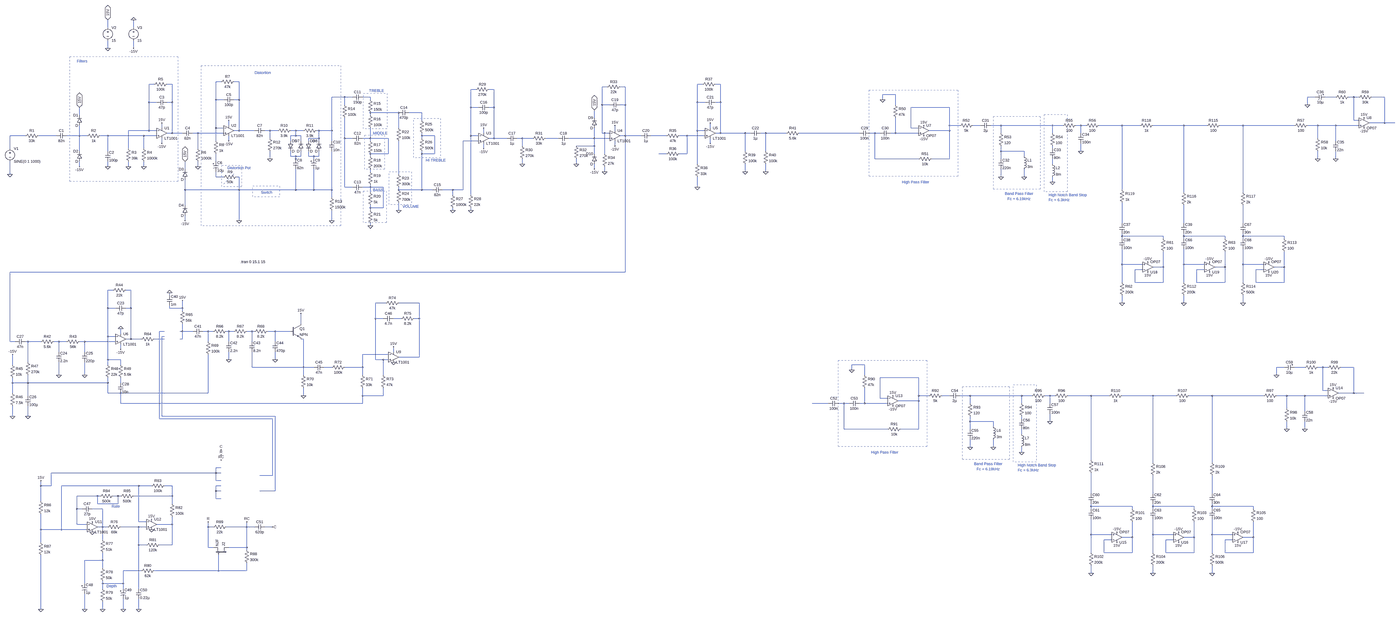
[diagram p0: schematic JC77.asc, whole sheet]
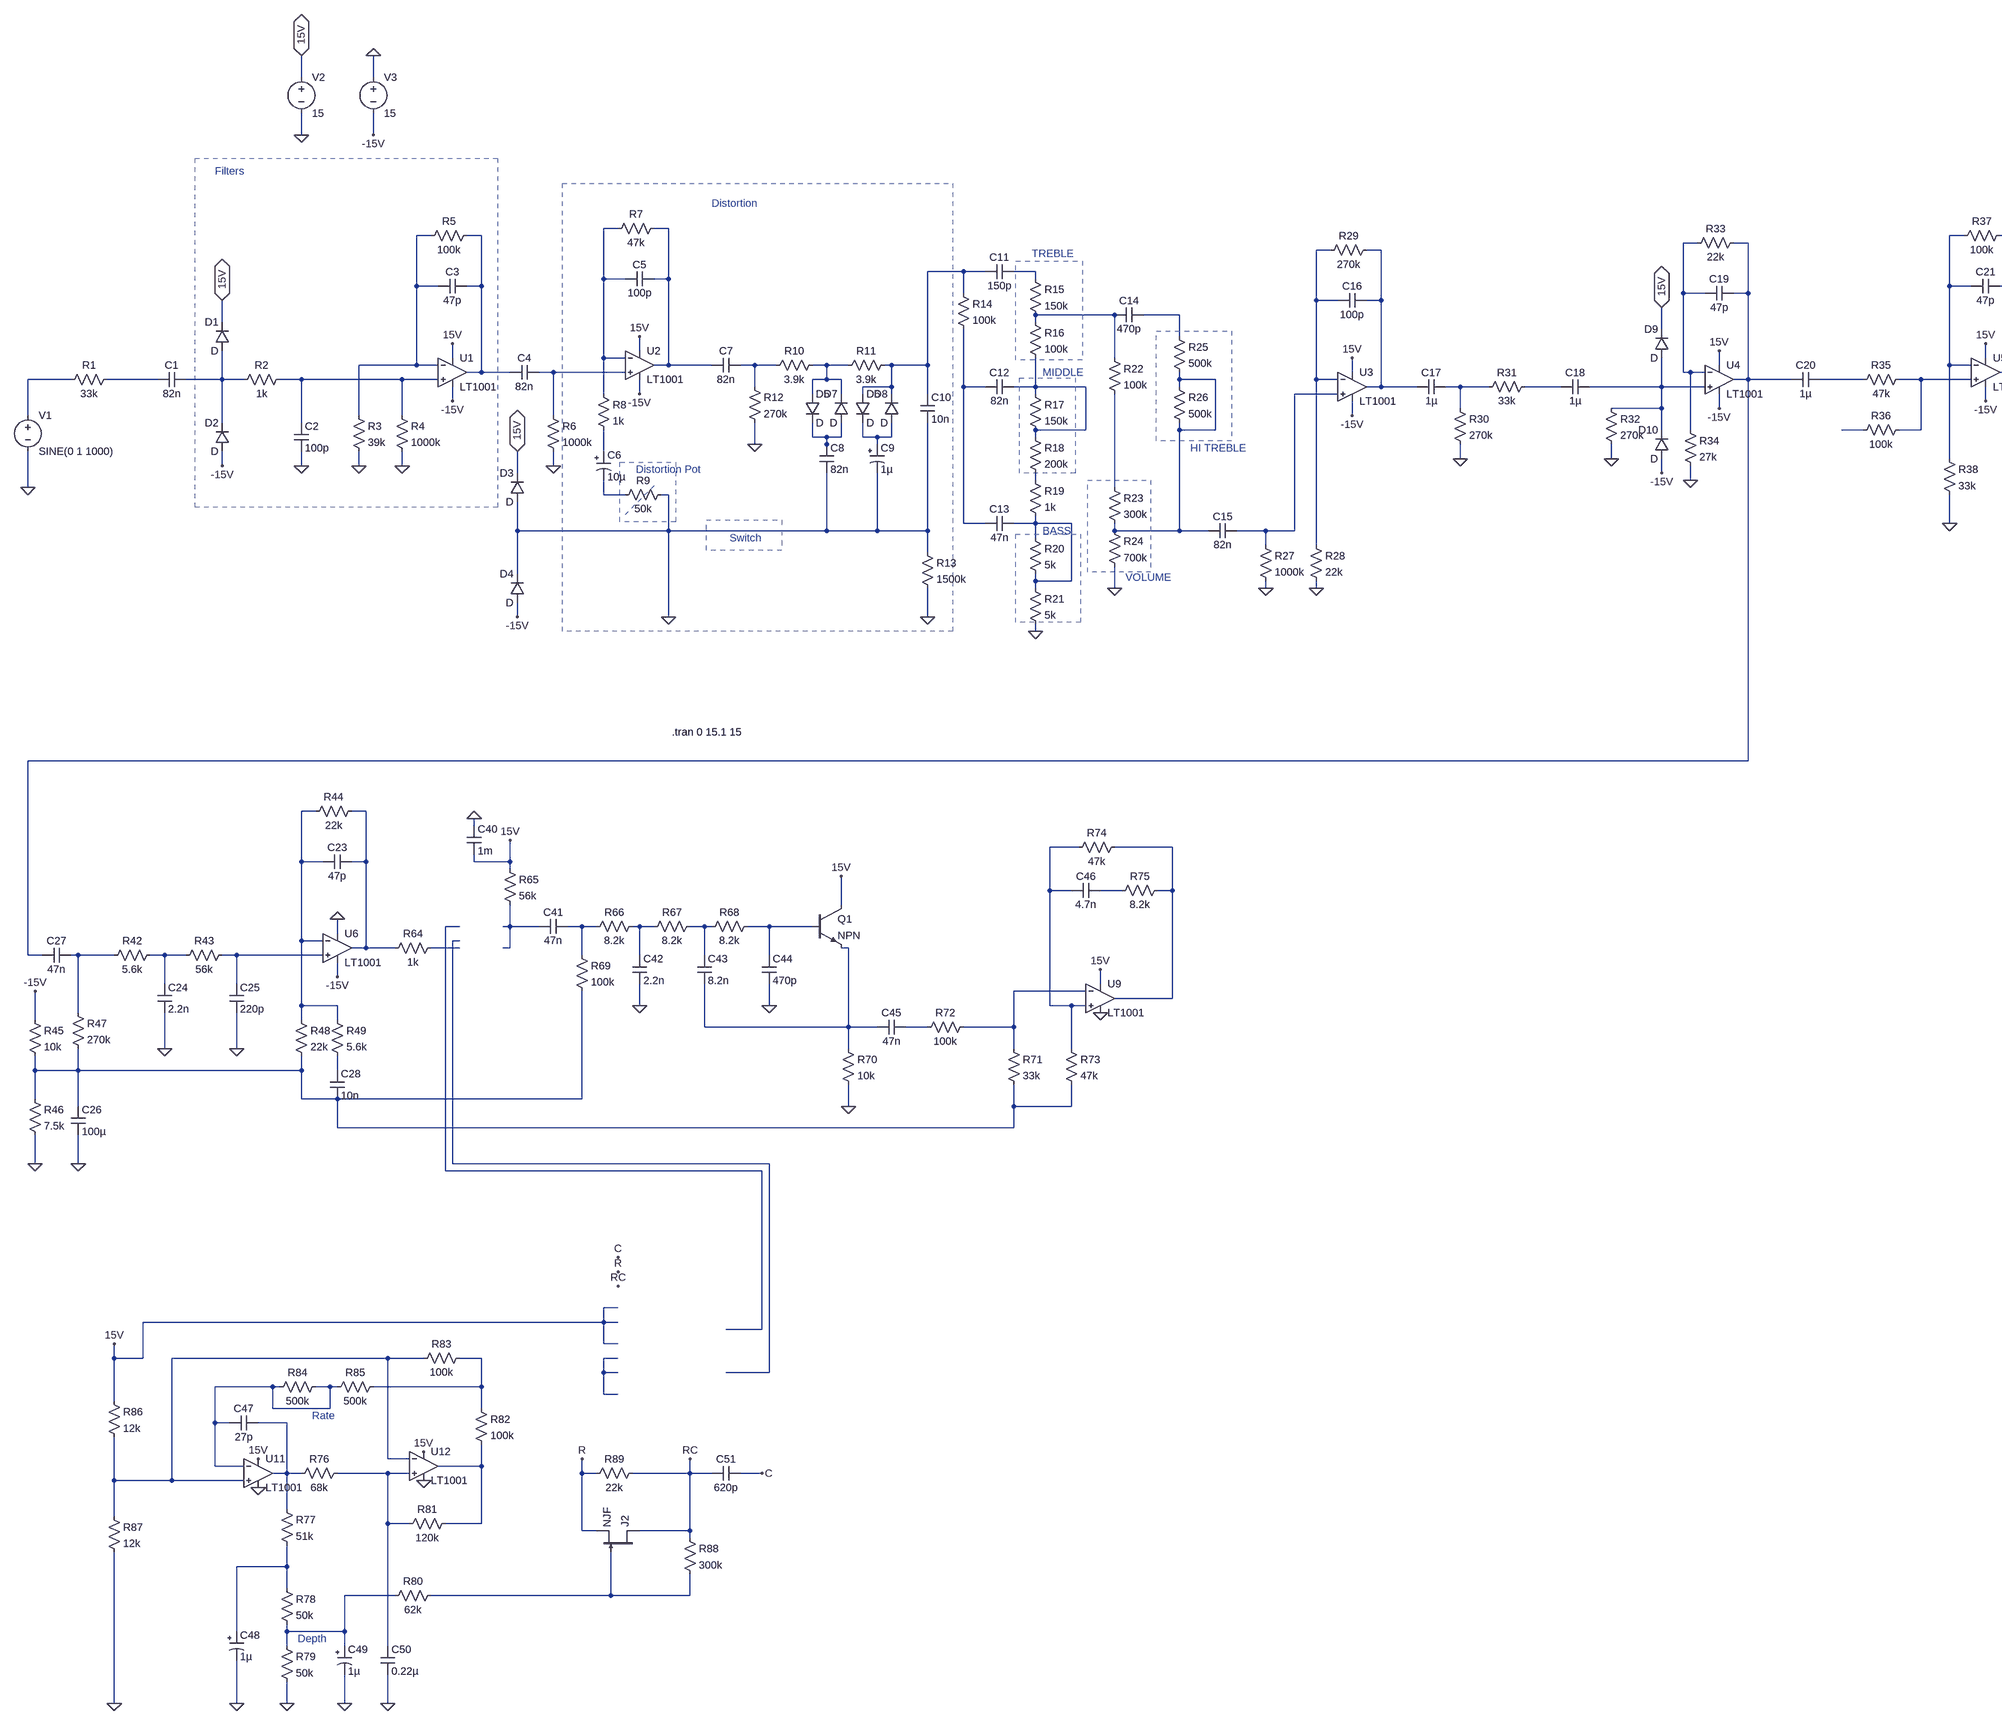
[diagram p1: schematic JC77.asc, part, row 1 of 1, column 1 of 2]
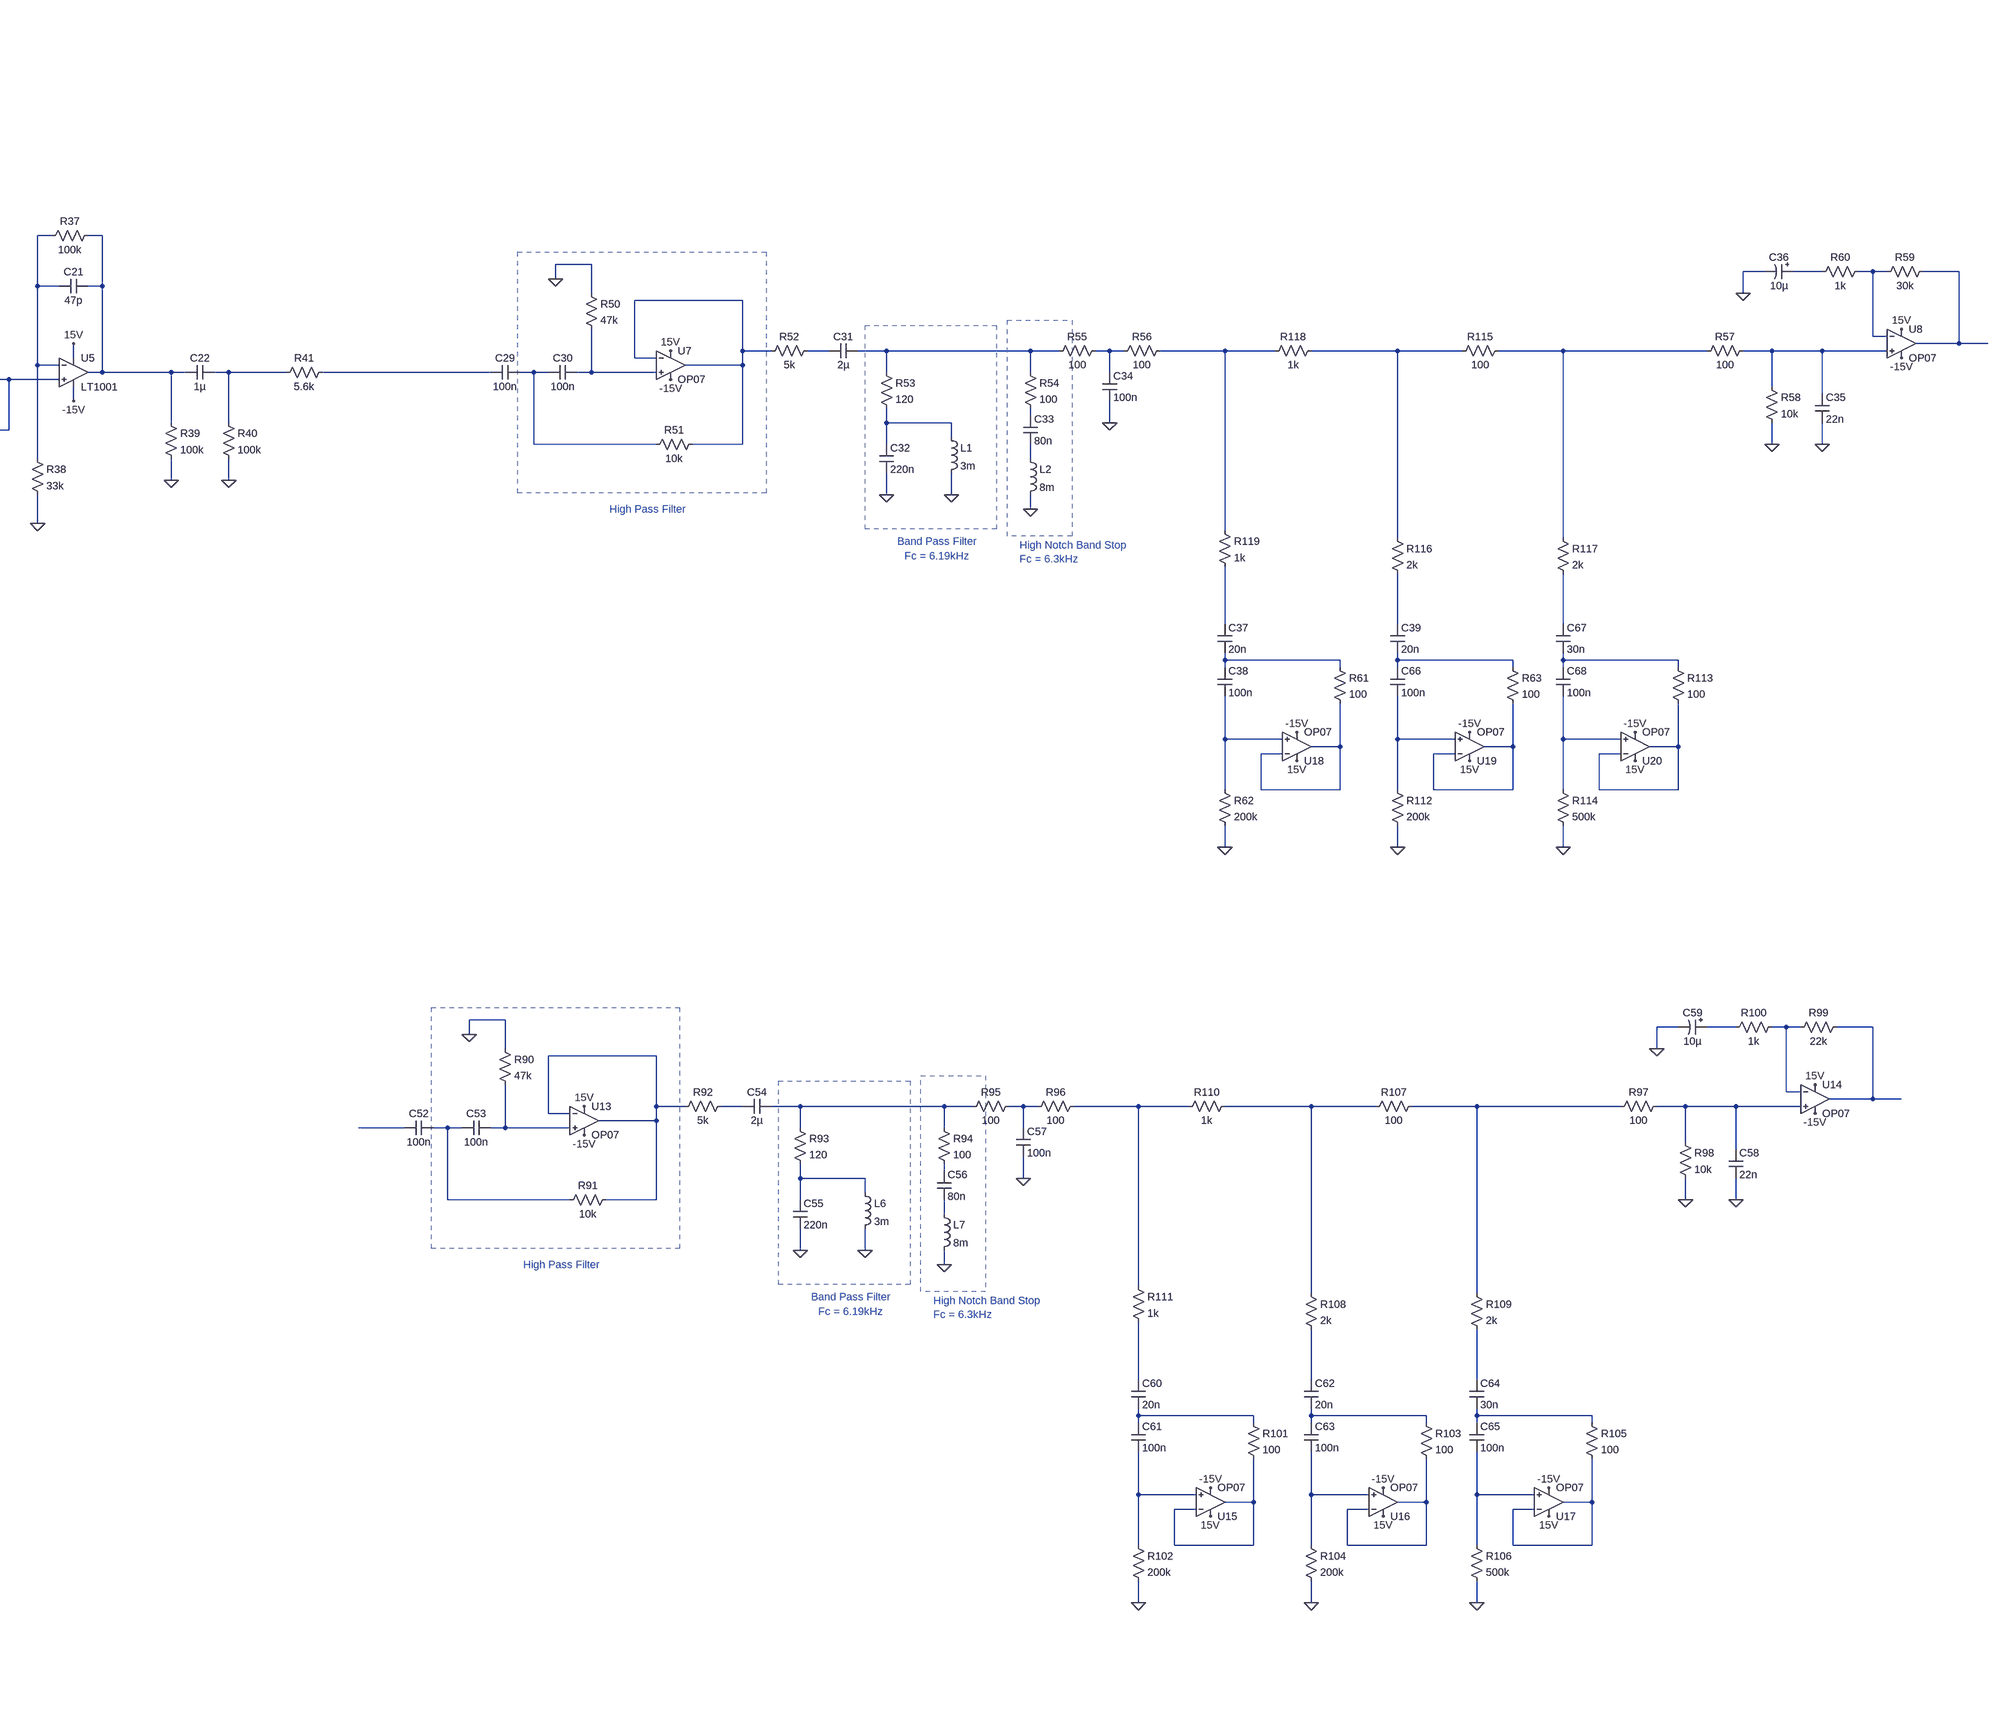
[diagram p2: schematic JC77.asc, part, row 1 of 1, column 2 of 2]
JC77.asc, the LTspice schematic file:
Version 4
SHEET 1 8596 3152
WIRE 496 -480 496 -528
WIRE 656 -480 656 -528
WIRE 496 -352 496 -400
WIRE 656 -352 656 -400
WIRE 1200 -144 1168 -144
WIRE 1312 -144 1280 -144
WIRE 784 -128 752 -128
WIRE 896 -128 864 -128
WIRE 4192 -128 4160 -128
WIRE 4304 -128 4272 -128
WIRE 3600 -112 3568 -112
WIRE 3712 -112 3680 -112
WIRE 2784 -96 2752 -96
WIRE 2896 -96 2864 -96
WIRE 5488 -64 5408 -64
WIRE 1968 -48 1888 -48
WIRE 2016 -48 1968 -48
WIRE 2128 -48 2080 -48
WIRE 8096 -48 8048 -48
WIRE 8224 -48 8160 -48
WIRE 8336 -48 8304 -48
WIRE 8368 -48 8336 -48
WIRE 8528 -48 8448 -48
WIRE 1168 -32 1168 -144
WIRE 1216 -32 1168 -32
WIRE 1312 -32 1312 -144
WIRE 1312 -32 1280 -32
WIRE 2128 -32 2128 -48
WIRE 5408 -32 5408 -64
WIRE 752 -16 752 -128
WIRE 800 -16 752 -16
WIRE 896 -16 896 -128
WIRE 896 -16 864 -16
WIRE 4160 -16 4160 -128
WIRE 4208 -16 4160 -16
WIRE 4304 -16 4304 -128
WIRE 4304 -16 4272 -16
WIRE 1968 0 1968 -48
WIRE 3568 0 3568 -112
WIRE 3616 0 3568 0
WIRE 3712 0 3712 -112
WIRE 3712 0 3680 0
WIRE 5488 0 5488 -64
WIRE 8048 0 8048 -48
WIRE 2752 16 2752 -96
WIRE 2800 16 2752 16
WIRE 2896 16 2896 -96
WIRE 2896 16 2864 16
WIRE 5824 16 5584 16
WIRE 2304 48 2128 48
WIRE 2448 48 2368 48
WIRE 320 64 320 16
WIRE 2128 64 2128 48
WIRE 3520 80 3520 32
WIRE 2448 96 2448 48
WIRE 8336 96 8336 -48
WIRE 8368 96 8336 96
WIRE 8528 112 8528 -48
WIRE 8528 112 8432 112
WIRE 8592 112 8528 112
WIRE 1248 128 1248 96
WIRE 5824 128 5824 16
WIRE 5888 128 5824 128
WIRE 6016 128 5968 128
WIRE 6144 128 6080 128
WIRE 6464 128 6144 128
WIRE 6528 128 6464 128
WIRE 6640 128 6608 128
WIRE 6672 128 6640 128
WIRE 6896 128 6752 128
WIRE 7008 128 6896 128
WIRE 7280 128 7088 128
WIRE 7424 128 7280 128
WIRE 7648 128 7504 128
WIRE 7968 128 7648 128
WIRE 8112 128 8048 128
WIRE 8224 128 8112 128
WIRE 8368 128 8224 128
WIRE 832 144 832 112
WIRE 1168 144 1168 -32
WIRE 1216 144 1168 144
WIRE 2304 144 2304 48
WIRE 4240 144 4240 112
WIRE 5584 144 5584 16
WIRE 5632 144 5584 144
WIRE 752 160 752 -16
WIRE 752 160 624 160
WIRE 800 160 752 160
WIRE 1312 160 1312 -32
WIRE 1312 160 1280 160
WIRE 1408 160 1312 160
WIRE 1504 160 1472 160
WIRE 1552 160 1504 160
WIRE 1664 160 1632 160
WIRE 1712 160 1664 160
WIRE 1808 160 1792 160
WIRE 1888 160 1888 -48
WIRE 1888 160 1808 160
WIRE 3648 160 3648 128
WIRE 4160 160 4160 -16
WIRE 4208 160 4160 160
WIRE 5824 160 5824 128
WIRE 5824 160 5696 160
WIRE 896 176 896 -16
WIRE 896 176 864 176
WIRE 960 176 896 176
WIRE 1056 176 1024 176
WIRE 1216 176 1056 176
WIRE 2832 176 2832 144
WIRE 3568 176 3568 0
WIRE 3584 176 3568 176
WIRE 3616 176 3584 176
WIRE 4304 176 4304 -16
WIRE 4304 176 4272 176
WIRE 4512 176 4304 176
WIRE 4544 176 4512 176
WIRE 4640 176 4608 176
WIRE 4768 176 4640 176
WIRE 5264 176 4848 176
WIRE 5360 176 5328 176
WIRE 5392 176 5360 176
WIRE 5488 176 5488 80
WIRE 5488 176 5456 176
WIRE 5632 176 5488 176
WIRE 6144 176 6144 128
WIRE 6464 176 6464 128
WIRE 6640 176 6640 128
WIRE -16 192 -112 192
WIRE 176 192 64 192
WIRE 320 192 320 128
WIRE 320 192 240 192
WIRE 368 192 320 192
WIRE 496 192 448 192
WIRE 720 192 496 192
WIRE 800 192 720 192
WIRE 1664 192 1664 160
WIRE 1664 192 1632 192
WIRE 1696 192 1664 192
WIRE 2448 192 2448 176
WIRE 2528 192 2448 192
WIRE 2752 192 2752 16
WIRE 2800 192 2752 192
WIRE 3712 192 3712 0
WIRE 3712 192 3680 192
WIRE 3808 192 3712 192
WIRE 3968 192 3872 192
WIRE 4096 192 4048 192
WIRE 4208 192 4096 192
WIRE 1504 208 1504 160
WIRE 1808 208 1808 160
WIRE 1808 208 1744 208
WIRE 1968 208 1968 80
WIRE 2016 208 1968 208
WIRE 2128 208 2128 144
WIRE 2128 208 2080 208
WIRE 2240 208 2128 208
WIRE 2448 208 2448 192
WIRE 2896 208 2896 16
WIRE 2896 208 2864 208
WIRE 2976 208 2896 208
WIRE 3072 208 3040 208
WIRE 3136 208 3072 208
WIRE 3296 208 3216 208
WIRE 3520 208 3520 144
WIRE 3520 208 3360 208
WIRE 3616 208 3520 208
WIRE 8112 208 8112 128
WIRE 1168 224 1168 144
WIRE 1248 224 1248 192
WIRE 1632 224 1632 192
WIRE 1696 224 1696 192
WIRE 1744 224 1744 208
WIRE 1808 224 1808 208
WIRE 1888 224 1888 160
WIRE 2128 224 2128 208
WIRE 2800 224 2704 224
WIRE 8224 224 8224 128
WIRE 832 240 832 208
WIRE 4240 240 4240 208
WIRE 3072 256 3072 208
WIRE 3520 256 3520 208
WIRE 3520 256 3408 256
WIRE 3648 256 3648 224
WIRE -112 272 -112 192
WIRE 624 272 624 160
WIRE 720 272 720 192
WIRE 1056 272 1056 176
WIRE 2832 272 2832 240
WIRE 6464 272 6464 256
WIRE 320 288 320 192
WIRE 496 288 496 192
WIRE 4512 288 4512 176
WIRE 4640 288 4640 176
WIRE 6144 288 6144 256
WIRE 6288 288 6144 288
WIRE 6640 288 6640 240
WIRE 2240 304 2240 208
WIRE 2240 304 2128 304
WIRE 2448 304 2448 288
WIRE 2528 304 2528 192
WIRE 2528 304 2448 304
WIRE 3520 304 3520 256
WIRE 3584 304 3584 176
WIRE 3968 304 3920 304
WIRE 4096 304 4096 192
WIRE 4096 304 4048 304
WIRE 1632 320 1632 288
WIRE 1664 320 1632 320
WIRE 1696 320 1696 288
WIRE 1696 320 1664 320
WIRE 1744 320 1744 288
WIRE 1776 320 1744 320
WIRE 1808 320 1808 288
WIRE 1808 320 1776 320
WIRE 2128 320 2128 304
WIRE 6288 320 6288 288
WIRE 1504 336 1504 288
WIRE 1664 336 1664 320
WIRE 1776 336 1776 320
WIRE 5360 336 5360 176
WIRE 5632 336 5360 336
WIRE 5824 336 5824 160
WIRE 5824 336 5712 336
WIRE 6144 336 6144 288
WIRE 8112 336 8112 288
WIRE 8224 336 8224 288
WIRE 1168 352 1168 304
WIRE 1664 352 1664 336
WIRE 3072 368 3072 336
WIRE 3408 368 3408 336
WIRE 4160 368 4160 160
WIRE 6464 368 6464 336
WIRE 320 384 320 352
WIRE 496 384 496 352
WIRE 624 384 624 352
WIRE 720 384 720 352
WIRE 1056 384 1056 352
WIRE 976 400 976 352
WIRE 3520 400 3520 368
WIRE 2128 416 2128 400
WIRE 3584 416 3584 384
WIRE 4512 416 4512 368
WIRE 4640 416 4640 368
WIRE -112 432 -112 352
WIRE 2304 432 2304 224
WIRE 1168 448 1168 416
WIRE 1216 448 1168 448
WIRE 1312 448 1296 448
WIRE 6144 448 6144 400
WIRE 6288 448 6288 400
WIRE 6464 480 6464 448
WIRE 1968 512 1968 208
WIRE 2016 512 1968 512
WIRE 2128 512 2128 496
WIRE 2128 512 2080 512
WIRE 2208 512 2128 512
WIRE 4160 512 4160 448
WIRE 976 528 976 464
WIRE 1312 528 1312 448
WIRE 1312 528 976 528
WIRE 1664 528 1664 400
WIRE 1664 528 1312 528
WIRE 1776 528 1776 400
WIRE 1776 528 1664 528
WIRE 1888 528 1888 288
WIRE 1888 528 1776 528
WIRE 2304 528 2304 512
WIRE 2448 528 2448 304
WIRE 2448 528 2304 528
WIRE 2512 528 2448 528
WIRE 2640 528 2576 528
WIRE 2704 528 2704 224
WIRE 2704 528 2640 528
WIRE 6896 528 6896 128
WIRE 2128 544 2128 512
WIRE 7280 544 7280 128
WIRE 7648 544 7648 128
WIRE 2640 560 2640 528
WIRE 2752 560 2752 192
WIRE 1888 576 1888 528
WIRE 976 624 976 528
WIRE 2128 640 2128 624
WIRE 2208 640 2208 512
WIRE 2208 640 2128 640
WIRE 2128 656 2128 640
WIRE 2304 656 2304 608
WIRE 2640 656 2640 640
WIRE 2752 656 2752 640
WIRE 976 720 976 688
WIRE 1312 720 1312 528
WIRE 1888 720 1888 656
WIRE 6896 736 6896 608
WIRE 7280 736 7280 624
WIRE 7648 736 7648 624
WIRE 2128 752 2128 736
WIRE 6896 816 6896 800
WIRE 7152 816 6896 816
WIRE 7280 816 7280 800
WIRE 7536 816 7280 816
WIRE 7648 816 7648 800
WIRE 7904 816 7648 816
WIRE 6896 832 6896 816
WIRE 7152 832 7152 816
WIRE 7280 832 7280 816
WIRE 7536 832 7536 816
WIRE 7648 832 7648 816
WIRE 7904 832 7904 816
WIRE 6896 992 6896 896
WIRE 7024 992 6896 992
WIRE 7280 992 7280 896
WIRE 7408 992 7280 992
WIRE 7648 992 7648 896
WIRE 7776 992 7648 992
WIRE 7152 1008 7152 912
WIRE 7152 1008 7088 1008
WIRE 7536 1008 7536 912
WIRE 7536 1008 7472 1008
WIRE 7904 1008 7904 912
WIRE 7904 1008 7840 1008
WIRE 7024 1024 6976 1024
WIRE 7408 1024 7360 1024
WIRE 7776 1024 7728 1024
WIRE 3712 1040 3712 192
WIRE 3712 1040 -112 1040
WIRE 6896 1104 6896 992
WIRE 6976 1104 6976 1024
WIRE 7152 1104 7152 1008
WIRE 7152 1104 6976 1104
WIRE 7280 1104 7280 992
WIRE 7360 1104 7360 1024
WIRE 7536 1104 7536 1008
WIRE 7536 1104 7360 1104
WIRE 7648 1104 7648 992
WIRE 7728 1104 7728 1024
WIRE 7904 1104 7904 1008
WIRE 7904 1104 7728 1104
WIRE 528 1152 496 1152
WIRE 640 1152 608 1152
WIRE 880 1184 880 1168
WIRE 2224 1232 2160 1232
WIRE 2432 1232 2304 1232
WIRE 6896 1232 6896 1184
WIRE 7280 1232 7280 1184
WIRE 7648 1232 7648 1184
WIRE 496 1264 496 1152
WIRE 544 1264 496 1264
WIRE 640 1264 640 1152
WIRE 640 1264 608 1264
WIRE 880 1264 880 1248
WIRE 960 1264 960 1216
WIRE 960 1264 880 1264
WIRE 960 1280 960 1264
WIRE 2160 1328 2160 1232
WIRE 2208 1328 2160 1328
WIRE 2320 1328 2272 1328
WIRE 2432 1328 2432 1232
WIRE 2432 1328 2400 1328
WIRE 1696 1360 1696 1296
WIRE 848 1408 816 1408
WIRE 960 1408 960 1360
WIRE 960 1408 944 1408
WIRE 1024 1408 960 1408
WIRE 1120 1408 1088 1408
WIRE 1152 1408 1120 1408
WIRE 1248 1408 1232 1408
WIRE 1280 1408 1248 1408
WIRE 1392 1408 1360 1408
WIRE 1408 1408 1392 1408
WIRE 1536 1408 1488 1408
WIRE 1632 1408 1536 1408
WIRE 576 1424 576 1392
WIRE 496 1440 496 1264
WIRE 544 1440 496 1440
WIRE 848 1440 832 1440
WIRE 640 1456 640 1264
WIRE 640 1456 608 1456
WIRE 704 1456 640 1456
WIRE 848 1456 784 1456
WIRE 960 1456 960 1408
WIRE 960 1456 944 1456
WIRE 1712 1456 1696 1456
WIRE -112 1472 -112 1040
WIRE -80 1472 -112 1472
WIRE 0 1472 -16 1472
WIRE 80 1472 0 1472
WIRE 192 1472 160 1472
WIRE 240 1472 192 1472
WIRE 352 1472 320 1472
WIRE 544 1472 352 1472
WIRE 1120 1472 1120 1408
WIRE 1248 1472 1248 1408
WIRE 1392 1472 1392 1408
WIRE 1536 1472 1536 1408
WIRE 576 1520 576 1488
WIRE 192 1536 192 1472
WIRE 352 1536 352 1472
WIRE 2272 1536 2272 1504
WIRE 2240 1552 2080 1552
WIRE 2432 1568 2432 1328
WIRE 2432 1568 2304 1568
WIRE 496 1584 496 1440
WIRE 576 1584 496 1584
WIRE 1248 1584 1248 1536
WIRE 1536 1584 1536 1536
WIRE 2160 1584 2160 1328
WIRE 2208 1584 2160 1584
WIRE 2240 1584 2208 1584
WIRE 0 1600 0 1472
WIRE -96 1616 -96 1552
WIRE 496 1616 496 1584
WIRE 576 1616 576 1584
WIRE 5296 1616 5216 1616
WIRE 1392 1632 1392 1536
WIRE 1712 1632 1712 1456
WIRE 1712 1632 1392 1632
WIRE 1776 1632 1712 1632
WIRE 1888 1632 1840 1632
WIRE 2080 1632 2080 1552
WIRE 2080 1632 1968 1632
WIRE 7904 1632 7856 1632
WIRE 8032 1632 7968 1632
WIRE 8144 1632 8112 1632
WIRE 8176 1632 8144 1632
WIRE 8336 1632 8256 1632
WIRE 5216 1648 5216 1616
WIRE 192 1680 192 1600
WIRE 352 1680 352 1600
WIRE 1712 1680 1712 1632
WIRE 2080 1680 2080 1632
WIRE 2208 1680 2208 1584
WIRE 5296 1680 5296 1616
WIRE 7856 1680 7856 1632
WIRE 5632 1696 5392 1696
WIRE -96 1728 -96 1696
WIRE 0 1728 0 1680
WIRE 0 1728 -96 1728
WIRE 496 1728 496 1696
WIRE 496 1728 0 1728
WIRE 576 1728 576 1696
WIRE 8144 1776 8144 1632
WIRE 8176 1776 8144 1776
WIRE -96 1792 -96 1728
WIRE 496 1792 496 1728
WIRE 576 1792 496 1792
WIRE 1120 1792 1120 1552
WIRE 1120 1792 576 1792
WIRE 8336 1792 8336 1632
WIRE 8336 1792 8240 1792
WIRE 8400 1792 8336 1792
WIRE 0 1808 0 1728
WIRE 1712 1808 1712 1760
WIRE 2080 1808 2080 1760
WIRE 2208 1808 2208 1760
WIRE 2208 1808 2080 1808
WIRE 5632 1808 5632 1696
WIRE 5696 1808 5632 1808
WIRE 5824 1808 5776 1808
WIRE 5952 1808 5888 1808
WIRE 6272 1808 5952 1808
WIRE 6336 1808 6272 1808
WIRE 6448 1808 6416 1808
WIRE 6480 1808 6448 1808
WIRE 6704 1808 6560 1808
WIRE 6816 1808 6704 1808
WIRE 7088 1808 6896 1808
WIRE 7232 1808 7088 1808
WIRE 7456 1808 7312 1808
WIRE 7776 1808 7456 1808
WIRE 7920 1808 7856 1808
WIRE 8032 1808 7920 1808
WIRE 8176 1808 8032 1808
WIRE 5392 1824 5392 1696
WIRE 5440 1824 5392 1824
WIRE 5632 1840 5632 1808
WIRE 5632 1840 5504 1840
WIRE 576 1856 576 1792
WIRE 2080 1856 2080 1808
WIRE 2080 1856 576 1856
WIRE 5072 1856 4928 1856
WIRE 5168 1856 5136 1856
WIRE 5200 1856 5168 1856
WIRE 5296 1856 5296 1760
WIRE 5296 1856 5264 1856
WIRE 5440 1856 5296 1856
WIRE 5952 1856 5952 1808
WIRE 6272 1856 6272 1808
WIRE 6448 1856 6448 1808
WIRE 7920 1888 7920 1808
WIRE 8032 1904 8032 1808
WIRE -96 1936 -96 1872
WIRE 0 1936 0 1872
WIRE 832 1936 832 1440
WIRE 1536 1936 832 1936
WIRE 816 1952 816 1408
WIRE 1520 1952 816 1952
WIRE 6272 1952 6272 1936
WIRE 5952 1968 5952 1936
WIRE 6096 1968 5952 1968
WIRE 6448 1968 6448 1920
WIRE 6096 2000 6096 1968
WIRE 5168 2016 5168 1856
WIRE 5440 2016 5168 2016
WIRE 5632 2016 5632 1840
WIRE 5632 2016 5520 2016
WIRE 5952 2016 5952 1968
WIRE 7920 2016 7920 1968
WIRE 8032 2016 8032 1968
WIRE 6272 2048 6272 2016
WIRE 5952 2128 5952 2080
WIRE 6096 2128 6096 2080
WIRE 6272 2160 6272 2128
WIRE 6704 2208 6704 1808
WIRE 7088 2224 7088 1808
WIRE 7456 2224 7456 1808
WIRE 1200 2256 1168 2256
WIRE 1168 2288 1168 2256
WIRE 1168 2288 144 2288
WIRE 1200 2288 1168 2288
WIRE 1520 2304 1520 1952
WIRE 1520 2304 1440 2304
WIRE 1168 2336 1168 2288
WIRE 1200 2336 1168 2336
WIRE 80 2368 80 2336
WIRE 144 2368 144 2288
WIRE 144 2368 80 2368
WIRE 688 2368 208 2368
WIRE 768 2368 688 2368
WIRE 896 2368 848 2368
WIRE 1200 2368 1168 2368
WIRE 1168 2400 1168 2368
WIRE 1200 2400 1168 2400
WIRE 1536 2400 1536 1936
WIRE 1536 2400 1440 2400
WIRE 6704 2416 6704 2288
WIRE 7088 2416 7088 2304
WIRE 7456 2416 7456 2304
WIRE 432 2432 304 2432
WIRE 448 2432 432 2432
WIRE 560 2432 528 2432
WIRE 576 2432 560 2432
WIRE 896 2432 896 2368
WIRE 896 2432 656 2432
WIRE 1168 2448 1168 2400
WIRE 1200 2448 1168 2448
WIRE 80 2464 80 2368
WIRE 432 2480 432 2432
WIRE 560 2480 560 2432
WIRE 560 2480 432 2480
WIRE 896 2480 896 2432
WIRE 6704 2496 6704 2480
WIRE 6960 2496 6704 2496
WIRE 7088 2496 7088 2480
WIRE 7344 2496 7088 2496
WIRE 7456 2496 7456 2480
WIRE 7712 2496 7456 2496
WIRE 304 2512 304 2432
WIRE 336 2512 304 2512
WIRE 464 2512 400 2512
WIRE 6704 2512 6704 2496
WIRE 6960 2512 6960 2496
WIRE 7088 2512 7088 2496
WIRE 7344 2512 7344 2496
WIRE 7456 2512 7456 2496
WIRE 7712 2512 7712 2496
WIRE 688 2592 688 2368
WIRE 736 2592 688 2592
WIRE 304 2608 304 2512
WIRE 368 2608 304 2608
WIRE 896 2608 896 2560
WIRE 896 2608 800 2608
WIRE 464 2624 464 2512
WIRE 464 2624 432 2624
WIRE 496 2624 464 2624
WIRE 688 2624 576 2624
WIRE 736 2624 688 2624
WIRE 1120 2624 1120 2592
WIRE 1152 2624 1120 2624
WIRE 1360 2624 1360 2592
WIRE 1360 2624 1232 2624
WIRE 1408 2624 1360 2624
WIRE 1520 2624 1472 2624
WIRE 80 2640 80 2544
WIRE 208 2640 208 2368
WIRE 208 2640 80 2640
WIRE 368 2640 208 2640
WIRE 6704 2672 6704 2576
WIRE 6832 2672 6704 2672
WIRE 7088 2672 7088 2576
WIRE 7216 2672 7088 2672
WIRE 7456 2672 7456 2576
WIRE 7584 2672 7456 2672
WIRE 6960 2688 6960 2592
WIRE 6960 2688 6896 2688
WIRE 7344 2688 7344 2592
WIRE 7344 2688 7280 2688
WIRE 7712 2688 7712 2592
WIRE 7712 2688 7648 2688
WIRE 464 2704 464 2624
WIRE 6832 2704 6784 2704
WIRE 7216 2704 7168 2704
WIRE 7584 2704 7536 2704
WIRE 80 2720 80 2640
WIRE 688 2736 688 2624
WIRE 736 2736 688 2736
WIRE 896 2736 896 2608
WIRE 896 2736 816 2736
WIRE 1120 2752 1120 2624
WIRE 1152 2752 1120 2752
WIRE 1360 2752 1360 2624
WIRE 1360 2752 1248 2752
WIRE 1360 2768 1360 2752
WIRE 6704 2784 6704 2672
WIRE 6784 2784 6784 2704
WIRE 6960 2784 6960 2688
WIRE 6960 2784 6784 2784
WIRE 7088 2784 7088 2672
WIRE 7168 2784 7168 2704
WIRE 7344 2784 7344 2688
WIRE 7344 2784 7168 2784
WIRE 7456 2784 7456 2672
WIRE 7536 2784 7536 2704
WIRE 7712 2784 7712 2688
WIRE 7712 2784 7536 2784
WIRE 464 2832 464 2784
WIRE 464 2832 352 2832
WIRE 464 2880 464 2832
WIRE 704 2896 592 2896
WIRE 1184 2896 1184 2800
WIRE 1184 2896 784 2896
WIRE 1360 2896 1360 2848
WIRE 1360 2896 1184 2896
WIRE 6704 2912 6704 2864
WIRE 7088 2912 7088 2864
WIRE 7456 2912 7456 2864
WIRE 352 2976 352 2832
WIRE 464 2976 464 2960
WIRE 592 2976 592 2896
WIRE 592 2976 464 2976
WIRE 464 3008 464 2976
WIRE 592 3008 592 2976
WIRE 688 3008 688 2736
WIRE 80 3136 80 2800
WIRE 352 3136 352 3040
WIRE 464 3136 464 3088
WIRE 592 3136 592 3072
WIRE 688 3136 688 3072
FLAG 496 384 0
FLAG 320 384 -15V
FLAG 624 384 0
FLAG 720 384 0
FLAG 832 240 -15V
FLAG 832 112 15V
FLAG 1056 384 0
FLAG 1248 224 -15V
FLAG 1248 96 15V
FLAG 976 720 -15V
FLAG 1312 720 0
FLAG 1504 336 0
FLAG 1888 720 0
FLAG 2128 752 0
FLAG 2304 656 0
FLAG 2640 656 0
FLAG 2832 272 -15V
FLAG 2832 144 15V
FLAG 2752 656 0
FLAG 3072 368 0
FLAG -112 432 0
FLAG 656 -528 0
FLAG 496 -352 0
FLAG 496 -528 15V
IOPIN 496 -528 BiDir
FLAG 320 16 15V
IOPIN 320 16 BiDir
FLAG 976 352 15V
IOPIN 976 352 BiDir
FLAG 656 -352 -15V
FLAG 3408 368 0
FLAG 3520 400 -15V
FLAG 3520 32 15V
IOPIN 3520 32 BiDir
FLAG 3648 256 -15V
FLAG 3648 128 15V
FLAG 3584 416 0
FLAG 4240 240 -15V
FLAG 4240 112 15V
FLAG 4512 416 0
FLAG 4640 416 0
FLAG 192 1680 0
FLAG 352 1680 0
FLAG -96 1936 0
FLAG -96 1552 -15V
FLAG 0 1936 0
FLAG 576 1392 0
FLAG 576 1520 -15V
FLAG 4160 512 0
FLAG 960 1216 15V
FLAG 880 1168 0
FLAG 1248 1584 0
FLAG 1536 1584 0
FLAG 1696 1296 15V
FLAG 1712 1808 0
FLAG 2272 1504 15V
FLAG 2272 1600 0
FLAG 464 3136 0
FLAG 352 3136 0
FLAG 592 3136 0
FLAG 688 3136 0
FLAG 80 2336 15V
FLAG 80 3136 0
FLAG 400 2592 15V
FLAG 768 2576 15V
FLAG 400 2656 0
FLAG 768 2640 0
FLAG 1200 2144 C
FLAG 1520 2624 C
FLAG 1360 2592 RC
FLAG 1200 2208 RC
FLAG 1120 2592 R
FLAG 1200 2176 R
FLAG 5216 1648 0
FLAG 5952 2128 0
FLAG 6096 2128 0
FLAG 6272 2160 0
FLAG 6448 1968 0
FLAG 7920 2016 0
FLAG 8032 2016 0
FLAG 7856 1680 0
FLAG 8208 1760 15V
FLAG 5472 1808 15V
FLAG 5472 1872 -15V
FLAG 8208 1824 -15V
FLAG 6704 2912 0
FLAG 6864 2656 -15V
FLAG 6864 2720 15V
FLAG 7088 2912 0
FLAG 7248 2656 -15V
FLAG 7248 2720 15V
FLAG 7456 2912 0
FLAG 7616 2656 -15V
FLAG 7616 2720 15V
FLAG 5408 -32 0
FLAG 6144 448 0
FLAG 6288 448 0
FLAG 6464 480 0
FLAG 6640 288 0
FLAG 8112 336 0
FLAG 8224 336 0
FLAG 8048 0 0
FLAG 8400 80 15V
FLAG 5664 128 15V
FLAG 5664 192 -15V
FLAG 8400 144 -15V
FLAG 6896 1232 0
FLAG 7056 976 -15V
FLAG 7056 1040 15V
FLAG 7280 1232 0
FLAG 7440 976 -15V
FLAG 7440 1040 15V
FLAG 7648 1232 0
FLAG 7808 976 -15V
FLAG 7808 1040 15V
SYMBOL Res 80 176 R90
WINDOW 0 0 56 VBottom 2
WINDOW 3 32 56 VTop 2
SYMATTR InstName R1
SYMATTR Value 33k
SYMBOL Cap 240 176 R90
WINDOW 0 0 32 VBottom 2
WINDOW 3 32 32 VTop 2
SYMATTR InstName C1
SYMATTR Value 82n
SYMBOL Diode 336 128 R180
WINDOW 0 24 64 Left 2
WINDOW 3 24 0 Left 2
SYMATTR InstName D1
SYMBOL Diode 336 352 R180
WINDOW 0 24 64 Left 2
WINDOW 3 24 0 Left 2
SYMATTR InstName D2
SYMBOL Res 464 176 R90
WINDOW 0 0 56 VBottom 2
WINDOW 3 32 56 VTop 2
SYMATTR InstName R2
SYMATTR Value 1k
SYMBOL Cap 480 288 R0
SYMATTR InstName C2
SYMATTR Value 100p
SYMBOL Res 608 256 R0
SYMATTR InstName R3
SYMATTR Value 39k
SYMBOL Res 704 256 R0
SYMATTR InstName R4
SYMATTR Value 1000k
SYMBOL Opamps/LT1001 832 112 R0
SYMATTR InstName U1
SYMBOL Cap 864 -32 R90
WINDOW 0 0 32 VBottom 2
WINDOW 3 32 32 VTop 2
SYMATTR InstName C3
SYMATTR Value 47p
SYMBOL Res 880 -144 R90
WINDOW 0 0 56 VBottom 2
WINDOW 3 32 56 VTop 2
SYMATTR InstName R5
SYMATTR Value 100k
SYMBOL Cap 1024 160 R90
WINDOW 0 0 32 VBottom 2
WINDOW 3 32 32 VTop 2
SYMATTR InstName C4
SYMATTR Value 82n
SYMBOL Res 1040 256 R0
SYMATTR InstName R6
SYMATTR Value 1000k
SYMBOL Opamps/LT1001 1248 96 R0
SYMATTR InstName U2
SYMBOL Cap 1280 -48 R90
WINDOW 0 0 32 VBottom 2
WINDOW 3 32 32 VTop 2
SYMATTR InstName C5
SYMATTR Value 100p
SYMBOL Res 1296 -160 R90
WINDOW 0 0 56 VBottom 2
WINDOW 3 32 56 VTop 2
SYMATTR InstName R7
SYMATTR Value 47k
SYMBOL Res 1152 208 R0
SYMATTR InstName R8
SYMATTR Value 1k
SYMBOL polcap 1152 352 R0
SYMATTR InstName C6
SYMATTR Value 10µ
SYMBOL Diode 992 464 R180
WINDOW 0 24 64 Left 2
WINDOW 3 24 0 Left 2
SYMATTR InstName D3
SYMBOL Diode 992 688 R180
WINDOW 0 24 64 Left 2
WINDOW 3 24 0 Left 2
SYMATTR InstName D4
SYMBOL Res 1312 432 R90
WINDOW 0 0 56 VBottom 2
WINDOW 3 32 56 VTop 2
SYMATTR InstName R9
SYMATTR Value 50k
SYMBOL Cap 1472 144 R90
WINDOW 0 0 32 VBottom 2
WINDOW 3 32 32 VTop 2
SYMATTR InstName C7
SYMATTR Value 82n
SYMBOL Res 1648 144 R90
WINDOW 0 0 56 VBottom 2
WINDOW 3 32 56 VTop 2
SYMATTR InstName R10
SYMATTR Value 3.9k
SYMBOL Res 1808 144 R90
WINDOW 0 0 56 VBottom 2
WINDOW 3 32 56 VTop 2
SYMATTR InstName R11
SYMATTR Value 3.9k
SYMBOL Res 1488 192 R0
SYMATTR InstName R12
SYMATTR Value 270k
SYMBOL Diode 1616 224 R0
SYMATTR InstName D5
SYMBOL Diode 1728 224 R0
SYMATTR InstName D6
SYMBOL Diode 1712 288 R180
WINDOW 0 24 64 Left 2
WINDOW 3 24 0 Left 2
SYMATTR InstName D7
SYMBOL Diode 1824 288 R180
WINDOW 0 24 64 Left 2
WINDOW 3 24 0 Left 2
SYMATTR InstName D8
SYMBOL Cap 1648 336 R0
SYMATTR InstName C8
SYMATTR Value 82n
SYMBOL polcap 1760 336 R0
SYMATTR InstName C9
SYMATTR Value 1µ
SYMBOL Cap 1872 224 R0
SYMATTR InstName C10
SYMATTR Value 10n
SYMBOL Res 1872 560 R0
SYMATTR InstName R13
SYMATTR Value 1500k
SYMBOL Res 1952 -16 R0
SYMATTR InstName R14
SYMATTR Value 100k
SYMBOL Cap 2080 -64 R90
WINDOW 0 0 32 VBottom 2
WINDOW 3 32 32 VTop 2
SYMATTR InstName C11
SYMATTR Value 150p
SYMBOL Res 2112 -48 R0
SYMATTR InstName R15
SYMATTR Value 150k
SYMBOL Res 2112 48 R0
SYMATTR InstName R16
SYMATTR Value 100k
SYMBOL Cap 2080 192 R90
WINDOW 0 0 32 VBottom 2
WINDOW 3 32 32 VTop 2
SYMATTR InstName C12
SYMATTR Value 82n
SYMBOL Cap 2080 496 R90
WINDOW 0 0 32 VBottom 2
WINDOW 3 32 32 VTop 2
SYMATTR InstName C13
SYMATTR Value 47n
SYMBOL Res 2112 208 R0
SYMATTR InstName R17
SYMATTR Value 150k
SYMBOL Res 2112 304 R0
SYMATTR InstName R18
SYMATTR Value 200k
SYMBOL Res 2112 400 R0
SYMATTR InstName R19
SYMATTR Value 1k
SYMBOL Res 2112 528 R0
SYMATTR InstName R20
SYMATTR Value 5k
SYMBOL Res 2112 640 R0
SYMATTR InstName R21
SYMATTR Value 5k
SYMBOL Cap 2368 32 R90
WINDOW 0 0 32 VBottom 2
WINDOW 3 32 32 VTop 2
SYMATTR InstName C14
SYMATTR Value 470p
SYMBOL Res 2288 128 R0
SYMATTR InstName R22
SYMATTR Value 100k
SYMBOL Res 2288 416 R0
SYMATTR InstName R23
SYMATTR Value 300k
SYMBOL Res 2288 512 R0
SYMATTR InstName R24
SYMATTR Value 700k
SYMBOL Res 2432 80 R0
SYMATTR InstName R25
SYMATTR Value 500k
SYMBOL Res 2432 192 R0
SYMATTR InstName R26
SYMATTR Value 500k
SYMBOL Cap 2576 512 R90
WINDOW 0 0 32 VBottom 2
WINDOW 3 32 32 VTop 2
SYMATTR InstName C15
SYMATTR Value 82n
SYMBOL Res 2624 544 R0
SYMATTR InstName R27
SYMATTR Value 1000k
SYMBOL Res 2736 544 R0
SYMATTR InstName R28
SYMATTR Value 22k
SYMBOL Opamps/LT1001 2832 144 R0
SYMATTR InstName U3
SYMBOL Cap 2864 0 R90
WINDOW 0 0 32 VBottom 2
WINDOW 3 32 32 VTop 2
SYMATTR InstName C16
SYMATTR Value 100p
SYMBOL Res 2880 -112 R90
WINDOW 0 0 56 VBottom 2
WINDOW 3 32 56 VTop 2
SYMATTR InstName R29
SYMATTR Value 270k
SYMBOL Cap 3040 192 R90
WINDOW 0 0 32 VBottom 2
WINDOW 3 32 32 VTop 2
SYMATTR InstName C17
SYMATTR Value 1µ
SYMBOL Res 3056 240 R0
SYMATTR InstName R30
SYMATTR Value 270k
SYMBOL Voltage -112 256 R0
SYMATTR InstName V1
SYMATTR Value SINE(0 1 1000)
SYMBOL Voltage 496 -496 R0
SYMATTR InstName V2
SYMATTR Value 15
SYMBOL Voltage 656 -496 R0
SYMATTR InstName V3
SYMATTR Value 15
SYMBOL Res 3232 192 R90
WINDOW 0 0 56 VBottom 2
WINDOW 3 32 56 VTop 2
SYMATTR InstName R31
SYMATTR Value 33k
SYMBOL Cap 3360 192 R90
WINDOW 0 0 32 VBottom 2
WINDOW 3 32 32 VTop 2
SYMATTR InstName C18
SYMATTR Value 1µ
SYMBOL Res 3392 240 R0
SYMATTR InstName R32
SYMATTR Value 270k
SYMBOL Diode 3536 144 R180
WINDOW 0 24 64 Left 2
WINDOW 3 24 0 Left 2
SYMATTR InstName D9
SYMBOL Diode 3536 368 R180
WINDOW 0 24 64 Left 2
WINDOW 3 24 0 Left 2
SYMATTR InstName D10
SYMBOL Opamps/LT1001 3648 128 R0
SYMATTR InstName U4
SYMBOL Cap 3680 -16 R90
WINDOW 0 0 32 VBottom 2
WINDOW 3 32 32 VTop 2
SYMATTR InstName C19
SYMATTR Value 47p
SYMBOL Res 3696 -128 R90
WINDOW 0 0 56 VBottom 2
WINDOW 3 32 56 VTop 2
SYMATTR InstName R33
SYMATTR Value 22k
SYMBOL Res 3568 288 R0
SYMATTR InstName R34
SYMATTR Value 27k
SYMBOL Cap 3872 176 R90
WINDOW 0 0 32 VBottom 2
WINDOW 3 32 32 VTop 2
SYMATTR InstName C20
SYMATTR Value 1µ
SYMBOL Res 4064 176 R90
WINDOW 0 0 56 VBottom 2
WINDOW 3 32 56 VTop 2
SYMATTR InstName R35
SYMATTR Value 47k
SYMBOL Res 4064 288 R90
WINDOW 0 0 56 VBottom 2
WINDOW 3 32 56 VTop 2
SYMATTR InstName R36
SYMATTR Value 100k
SYMBOL Opamps/LT1001 4240 112 R0
SYMATTR InstName U5
SYMBOL Cap 4272 -32 R90
WINDOW 0 0 32 VBottom 2
WINDOW 3 32 32 VTop 2
SYMATTR InstName C21
SYMATTR Value 47p
SYMBOL Res 4288 -144 R90
WINDOW 0 0 56 VBottom 2
WINDOW 3 32 56 VTop 2
SYMATTR InstName R37
SYMATTR Value 100k
SYMBOL Res 4144 352 R0
SYMATTR InstName R38
SYMATTR Value 33k
SYMBOL Res 4496 272 R0
SYMATTR InstName R39
SYMATTR Value 100k
SYMBOL Res 4624 272 R0
SYMATTR InstName R40
SYMATTR Value 100k
SYMBOL Cap 4608 160 R90
WINDOW 0 0 32 VBottom 2
WINDOW 3 32 32 VTop 2
SYMATTR InstName C22
SYMATTR Value 1µ
SYMBOL Res 4864 160 R90
WINDOW 0 0 56 VBottom 2
WINDOW 3 32 56 VTop 2
SYMATTR InstName R41
SYMATTR Value 5.6k
SYMBOL Res 176 1456 R90
WINDOW 0 0 56 VBottom 2
WINDOW 3 32 56 VTop 2
SYMATTR InstName R42
SYMATTR Value 5.6k
SYMBOL Res 336 1456 R90
WINDOW 0 0 56 VBottom 2
WINDOW 3 32 56 VTop 2
SYMATTR InstName R43
SYMATTR Value 56k
SYMBOL Cap 176 1536 R0
SYMATTR InstName C24
SYMATTR Value 2.2n
SYMBOL Cap 336 1536 R0
SYMATTR InstName C25
SYMATTR Value 220p
SYMBOL Res -112 1600 R0
SYMATTR InstName R45
SYMATTR Value 10k
SYMBOL Res -112 1776 R0
SYMATTR InstName R46
SYMATTR Value 7.5k
SYMBOL Cap -16 1808 R0
SYMATTR InstName C26
SYMATTR Value 100µ
SYMBOL Res -16 1584 R0
SYMATTR InstName R47
SYMATTR Value 270k
SYMBOL Cap -16 1456 R90
WINDOW 0 0 32 VBottom 2
WINDOW 3 32 32 VTop 2
SYMATTR InstName C27
SYMATTR Value 47n
SYMBOL Opamps/LT1001 576 1392 R0
SYMATTR InstName U6
SYMBOL Cap 608 1248 R90
WINDOW 0 0 32 VBottom 2
WINDOW 3 32 32 VTop 2
SYMATTR InstName C23
SYMATTR Value 47p
SYMBOL Res 624 1136 R90
WINDOW 0 0 56 VBottom 2
WINDOW 3 32 56 VTop 2
SYMATTR InstName R44
SYMATTR Value 22k
SYMBOL Res 480 1600 R0
SYMATTR InstName R48
SYMATTR Value 22k
SYMBOL Res 560 1600 R0
SYMATTR InstName R49
SYMATTR Value 5.6k
SYMBOL Cap 560 1728 R0
SYMATTR InstName C28
SYMATTR Value 10n
SYMBOL Res 800 1440 R90
WINDOW 0 0 56 VBottom 2
WINDOW 3 32 56 VTop 2
SYMATTR InstName R64
SYMATTR Value 1k
SYMBOL Res 944 1264 R0
SYMATTR InstName R65
SYMATTR Value 56k
SYMBOL Cap 864 1184 R0
SYMATTR InstName C40
SYMATTR Value 1m
SYMBOL Cap 1088 1424 M270
WINDOW 0 32 32 VTop 2
WINDOW 3 0 32 VBottom 2
SYMATTR InstName C41
SYMATTR Value 47n
SYMBOL Res 1248 1392 R90
WINDOW 0 0 56 VBottom 2
WINDOW 3 32 56 VTop 2
SYMATTR InstName R66
SYMATTR Value 8.2k
SYMBOL Res 1376 1392 R90
WINDOW 0 0 56 VBottom 2
WINDOW 3 32 56 VTop 2
SYMATTR InstName R67
SYMATTR Value 8.2k
SYMBOL Res 1504 1392 R90
WINDOW 0 0 56 VBottom 2
WINDOW 3 32 56 VTop 2
SYMATTR InstName R68
SYMATTR Value 8.2k
SYMBOL Res 1104 1456 R0
SYMATTR InstName R69
SYMATTR Value 100k
SYMBOL Cap 1232 1472 R0
SYMATTR InstName C42
SYMATTR Value 2.2n
SYMBOL Cap 1376 1472 R0
SYMATTR InstName C43
SYMATTR Value 8.2n
SYMBOL Cap 1520 1472 R0
SYMATTR InstName C44
SYMATTR Value 470p
SYMBOL npn 1632 1360 R0
SYMATTR InstName Q1
SYMBOL Res 1696 1664 R0
SYMATTR InstName R70
SYMATTR Value 10k
SYMBOL Cap 1840 1616 R90
WINDOW 0 0 32 VBottom 2
WINDOW 3 32 32 VTop 2
SYMATTR InstName C45
SYMATTR Value 47n
SYMBOL Res 1984 1616 R90
WINDOW 0 0 56 VBottom 2
WINDOW 3 32 56 VTop 2
SYMATTR InstName R72
SYMATTR Value 100k
SYMBOL Res 2064 1664 R0
SYMATTR InstName R71
SYMATTR Value 33k
SYMBOL Res 2192 1664 R0
SYMATTR InstName R73
SYMATTR Value 47k
SYMBOL Opamps/LT1001 2272 1504 R0
SYMATTR InstName U9
SYMBOL Res 2320 1216 R90
WINDOW 0 0 56 VBottom 2
WINDOW 3 32 56 VTop 2
SYMATTR InstName R74
SYMATTR Value 47k
SYMBOL Res 2416 1312 R90
WINDOW 0 0 56 VBottom 2
WINDOW 3 32 56 VTop 2
SYMATTR InstName R75
SYMATTR Value 8.2k
SYMBOL Cap 2272 1312 R90
WINDOW 0 0 32 VBottom 2
WINDOW 3 32 32 VTop 2
SYMATTR InstName C46
SYMATTR Value 4.7n
SYMBOL Opamps/LT1001 400 2560 R0
SYMATTR InstName U11
SYMBOL Opamps/LT1001 768 2544 R0
SYMATTR InstName U12
SYMBOL Res 592 2608 R90
WINDOW 0 0 56 VBottom 2
WINDOW 3 32 56 VTop 2
SYMATTR InstName R76
SYMATTR Value 68k
SYMBOL Cap 400 2528 M270
WINDOW 0 32 32 VTop 2
WINDOW 3 0 32 VBottom 2
SYMATTR InstName C47
SYMATTR Value 27p
SYMBOL Res 448 2688 R0
SYMATTR InstName R77
SYMATTR Value 51k
SYMBOL Res 448 2864 R0
SYMATTR InstName R78
SYMATTR Value 50k
SYMBOL Res 448 2992 R0
SYMATTR InstName R79
SYMATTR Value 50k
SYMBOL polcap 336 2976 R0
SYMATTR InstName C48
SYMATTR Value 1µ
SYMBOL polcap 576 3008 R0
SYMATTR InstName C49
SYMATTR Value 1µ
SYMBOL Res 800 2880 R90
WINDOW 0 0 56 VBottom 2
WINDOW 3 32 56 VTop 2
SYMATTR InstName R80
SYMATTR Value 62k
SYMBOL Cap 672 3008 R0
SYMATTR InstName C50
SYMATTR Value 0.22µ
SYMBOL Res 832 2720 R90
WINDOW 0 0 56 VBottom 2
WINDOW 3 32 56 VTop 2
SYMATTR InstName R81
SYMATTR Value 120k
SYMBOL Res 880 2464 R0
SYMATTR InstName R82
SYMATTR Value 100k
SYMBOL Res 864 2352 R90
WINDOW 0 0 56 VBottom 2
WINDOW 3 32 56 VTop 2
SYMATTR InstName R83
SYMATTR Value 100k
SYMBOL Res 544 2416 R90
WINDOW 0 0 56 VBottom 2
WINDOW 3 32 56 VTop 2
SYMATTR InstName R84
SYMATTR Value 500k
SYMBOL Res 672 2416 R90
WINDOW 0 0 56 VBottom 2
WINDOW 3 32 56 VTop 2
SYMATTR InstName R85
SYMATTR Value 500k
SYMBOL Res 64 2448 R0
SYMATTR InstName R86
SYMATTR Value 12k
SYMBOL Res 64 2704 R0
SYMATTR InstName R87
SYMATTR Value 12k
SYMBOL njf 1248 2800 M270
SYMATTR InstName J2
SYMBOL Res 1344 2752 R0
SYMATTR InstName R88
SYMATTR Value 300k
SYMBOL Res 1248 2608 R90
WINDOW 0 0 56 VBottom 2
WINDOW 3 32 56 VTop 2
SYMATTR InstName R89
SYMATTR Value 22k
SYMBOL Cap 1472 2608 R90
WINDOW 0 0 32 VBottom 2
WINDOW 3 32 32 VTop 2
SYMATTR InstName C51
SYMATTR Value 620p
SYMBOL Opamps/OP07 5472 1776 R0
SYMATTR InstName U13
SYMBOL Cap 5136 1840 R90
WINDOW 0 0 32 VBottom 2
WINDOW 3 32 32 VTop 2
SYMATTR InstName C52
SYMATTR Value 100n
SYMBOL Cap 5264 1840 R90
WINDOW 0 0 32 VBottom 2
WINDOW 3 32 32 VTop 2
SYMATTR InstName C53
SYMATTR Value 100n
SYMBOL Res 5280 1664 R0
SYMATTR InstName R90
SYMATTR Value 47k
SYMBOL Res 5536 2000 R90
WINDOW 0 0 56 VBottom 2
WINDOW 3 32 56 VTop 2
SYMATTR InstName R91
SYMATTR Value 10k
SYMBOL Res 5792 1792 R90
WINDOW 0 0 56 VBottom 2
WINDOW 3 32 56 VTop 2
SYMATTR InstName R92
SYMATTR Value 5k
SYMBOL Cap 5888 1792 R90
WINDOW 0 0 32 VBottom 2
WINDOW 3 32 32 VTop 2
SYMATTR InstName C54
SYMATTR Value 2µ
SYMBOL Res 5936 1840 R0
SYMATTR InstName R93
SYMATTR Value 120
SYMBOL Cap 5936 2016 R0
SYMATTR InstName C55
SYMATTR Value 220n
SYMBOL Ind 6080 1984 R0
SYMATTR InstName L6
SYMATTR Value 3m
SYMBOL Res 6256 1840 R0
SYMATTR InstName R94
SYMATTR Value 100
SYMBOL Cap 6256 1952 R0
SYMATTR InstName C56
SYMATTR Value 80n
SYMBOL Ind 6256 2032 R0
SYMATTR InstName L7
SYMATTR Value 8m
SYMBOL Res 6432 1792 R90
WINDOW 0 0 56 VBottom 2
WINDOW 3 32 56 VTop 2
SYMATTR InstName R95
SYMATTR Value 100
SYMBOL Res 6576 1792 R90
WINDOW 0 0 56 VBottom 2
WINDOW 3 32 56 VTop 2
SYMATTR InstName R96
SYMATTR Value 100
SYMBOL Cap 6432 1856 R0
SYMATTR InstName C57
SYMATTR Value 100n
SYMBOL Res 7872 1792 R90
WINDOW 0 0 56 VBottom 2
WINDOW 3 32 56 VTop 2
SYMATTR InstName R97
SYMATTR Value 100
SYMBOL Res 7904 1872 R0
SYMATTR InstName R98
SYMATTR Value 10k
SYMBOL Cap 8016 1904 R0
SYMATTR InstName C58
SYMATTR Value 22n
SYMBOL Opamps/OP07 8208 1728 R0
SYMATTR InstName U14
SYMBOL Res 8272 1616 R90
WINDOW 0 0 56 VBottom 2
WINDOW 3 32 56 VTop 2
SYMATTR InstName R99
SYMATTR Value 22k
SYMBOL Res 8128 1616 R90
WINDOW 0 0 56 VBottom 2
WINDOW 3 32 56 VTop 2
SYMATTR InstName R100
SYMATTR Value 1k
SYMBOL polcap 7968 1616 R90
WINDOW 0 0 32 VBottom 2
WINDOW 3 32 32 VTop 2
SYMATTR InstName C59
SYMATTR Value 10µ
SYMBOL Cap 6688 2416 R0
SYMATTR InstName C60
SYMATTR Value 20n
SYMBOL Cap 6688 2512 R0
SYMATTR InstName C61
SYMATTR Value 100n
SYMBOL Res 6944 2496 R0
SYMATTR InstName R101
SYMATTR Value 100
SYMBOL Res 6688 2768 R0
SYMATTR InstName R102
SYMATTR Value 200k
SYMBOL Opamps/OP07 6864 2752 M180
SYMATTR InstName U15
SYMBOL Cap 7072 2416 R0
SYMATTR InstName C62
SYMATTR Value 20n
SYMBOL Cap 7072 2512 R0
SYMATTR InstName C63
SYMATTR Value 100n
SYMBOL Res 7328 2496 R0
SYMATTR InstName R103
SYMATTR Value 100
SYMBOL Res 7072 2768 R0
SYMATTR InstName R104
SYMATTR Value 200k
SYMBOL Opamps/OP07 7248 2752 M180
SYMATTR InstName U16
SYMBOL Cap 7440 2416 R0
SYMATTR InstName C64
SYMATTR Value 30n
SYMBOL Cap 7440 2512 R0
SYMATTR InstName C65
SYMATTR Value 100n
SYMBOL Res 7696 2496 R0
SYMATTR InstName R105
SYMATTR Value 100
SYMBOL Res 7440 2768 R0
SYMATTR InstName R106
SYMATTR Value 500k
SYMBOL Opamps/OP07 7616 2752 M180
SYMATTR InstName U17
SYMBOL Res 7328 1792 R90
WINDOW 0 0 56 VBottom 2
WINDOW 3 32 56 VTop 2
SYMATTR InstName R107
SYMATTR Value 100
SYMBOL Res 7072 2208 R0
SYMATTR InstName R108
SYMATTR Value 2k
SYMBOL Res 7440 2208 R0
SYMATTR InstName R109
SYMATTR Value 2k
SYMBOL Res 6912 1792 R90
WINDOW 0 0 56 VBottom 2
WINDOW 3 32 56 VTop 2
SYMATTR InstName R110
SYMATTR Value 1k
SYMBOL Res 6688 2192 R0
SYMATTR InstName R111
SYMATTR Value 1k
SYMBOL Opamps/OP07 5664 96 R0
SYMATTR InstName U7
SYMBOL Cap 5328 160 R90
WINDOW 0 0 32 VBottom 2
WINDOW 3 32 32 VTop 2
SYMATTR InstName C29
SYMATTR Value 100n
SYMBOL Cap 5456 160 R90
WINDOW 0 0 32 VBottom 2
WINDOW 3 32 32 VTop 2
SYMATTR InstName C30
SYMATTR Value 100n
SYMBOL Res 5472 -16 R0
SYMATTR InstName R50
SYMATTR Value 47k
SYMBOL Res 5728 320 R90
WINDOW 0 0 56 VBottom 2
WINDOW 3 32 56 VTop 2
SYMATTR InstName R51
SYMATTR Value 10k
SYMBOL Res 5984 112 R90
WINDOW 0 0 56 VBottom 2
WINDOW 3 32 56 VTop 2
SYMATTR InstName R52
SYMATTR Value 5k
SYMBOL Cap 6080 112 R90
WINDOW 0 0 32 VBottom 2
WINDOW 3 32 32 VTop 2
SYMATTR InstName C31
SYMATTR Value 2µ
SYMBOL Res 6128 160 R0
SYMATTR InstName R53
SYMATTR Value 120
SYMBOL Cap 6128 336 R0
SYMATTR InstName C32
SYMATTR Value 220n
SYMBOL Ind 6272 304 R0
SYMATTR InstName L1
SYMATTR Value 3m
SYMBOL Res 6448 160 R0
SYMATTR InstName R54
SYMATTR Value 100
SYMBOL Cap 6448 272 R0
SYMATTR InstName C33
SYMATTR Value 80n
SYMBOL Ind 6448 352 R0
SYMATTR InstName L2
SYMATTR Value 8m
SYMBOL Res 6624 112 R90
WINDOW 0 0 56 VBottom 2
WINDOW 3 32 56 VTop 2
SYMATTR InstName R55
SYMATTR Value 100
SYMBOL Res 6768 112 R90
WINDOW 0 0 56 VBottom 2
WINDOW 3 32 56 VTop 2
SYMATTR InstName R56
SYMATTR Value 100
SYMBOL Cap 6624 176 R0
SYMATTR InstName C34
SYMATTR Value 100n
SYMBOL Res 8064 112 R90
WINDOW 0 0 56 VBottom 2
WINDOW 3 32 56 VTop 2
SYMATTR InstName R57
SYMATTR Value 100
SYMBOL Res 8096 192 R0
SYMATTR InstName R58
SYMATTR Value 10k
SYMBOL Cap 8208 224 R0
SYMATTR InstName C35
SYMATTR Value 22n
SYMBOL Opamps/OP07 8400 48 R0
SYMATTR InstName U8
SYMBOL Res 8464 -64 R90
WINDOW 0 0 56 VBottom 2
WINDOW 3 32 56 VTop 2
SYMATTR InstName R59
SYMATTR Value 30k
SYMBOL Res 8320 -64 R90
WINDOW 0 0 56 VBottom 2
WINDOW 3 32 56 VTop 2
SYMATTR InstName R60
SYMATTR Value 1k
SYMBOL polcap 8160 -64 R90
WINDOW 0 0 32 VBottom 2
WINDOW 3 32 32 VTop 2
SYMATTR InstName C36
SYMATTR Value 10µ
SYMBOL Cap 6880 736 R0
SYMATTR InstName C37
SYMATTR Value 20n
SYMBOL Cap 6880 832 R0
SYMATTR InstName C38
SYMATTR Value 100n
SYMBOL Res 7136 816 R0
SYMATTR InstName R61
SYMATTR Value 100
SYMBOL Res 6880 1088 R0
SYMATTR InstName R62
SYMATTR Value 200k
SYMBOL Opamps/OP07 7056 1072 M180
SYMATTR InstName U18
SYMBOL Cap 7264 736 R0
SYMATTR InstName C39
SYMATTR Value 20n
SYMBOL Cap 7264 832 R0
SYMATTR InstName C66
SYMATTR Value 100n
SYMBOL Res 7520 816 R0
SYMATTR InstName R63
SYMATTR Value 100
SYMBOL Res 7264 1088 R0
SYMATTR InstName R112
SYMATTR Value 200k
SYMBOL Opamps/OP07 7440 1072 M180
SYMATTR InstName U19
SYMBOL Cap 7632 736 R0
SYMATTR InstName C67
SYMATTR Value 30n
SYMBOL Cap 7632 832 R0
SYMATTR InstName C68
SYMATTR Value 100n
SYMBOL Res 7888 816 R0
SYMATTR InstName R113
SYMATTR Value 100
SYMBOL Res 7632 1088 R0
SYMATTR InstName R114
SYMATTR Value 500k
SYMBOL Opamps/OP07 7808 1072 M180
SYMATTR InstName U20
SYMBOL Res 7520 112 R90
WINDOW 0 0 56 VBottom 2
WINDOW 3 32 56 VTop 2
SYMATTR InstName R115
SYMATTR Value 100
SYMBOL Res 7264 528 R0
SYMATTR InstName R116
SYMATTR Value 2k
SYMBOL Res 7632 528 R0
SYMATTR InstName R117
SYMATTR Value 2k
SYMBOL Res 7104 112 R90
WINDOW 0 0 56 VBottom 2
WINDOW 3 32 56 VTop 2
SYMATTR InstName R118
SYMATTR Value 1k
SYMBOL Res 6880 512 R0
SYMATTR InstName R119
SYMATTR Value 1k
TEXT 1240 392 Left 2 ;Distortion Pot
TEXT 2328 632 Left 2 ;VOLUME
TEXT 2472 344 Left 2 ;HI TREBLE
TEXT 2120 -88 Left 2 ;TREBLE
TEXT 2144 176 Left 2 ;MIDDLE
TEXT 2144 528 Left 2 ;BASS
TEXT 1448 544 Left 2 ;Switch
TEXT 1320 976 Left 2 !.tran 0 15.1 15
TEXT 304 -272 Left 2 ;Filters
TEXT 1408 -200 Left 2 ;Distortion
TEXT 520 2496 Left 2 ;Rate
TEXT 488 2992 Left 2 ;Depth
TEXT 5976 2232 Left 2 ;Band Pass Filter
TEXT 6248 2240 Left 2 ;High Notch Band Stop\nFc = 6.3kHz
TEXT 5336 2160 Left 2 ;High Pass Filter
TEXT 5992 2264 Left 2 ;Fc = 6.19kHz
TEXT 6168 552 Left 2 ;Band Pass Filter
TEXT 6440 560 Left 2 ;High Notch Band Stop\nFc = 6.3kHz
TEXT 5528 480 Left 2 ;High Pass Filter
TEXT 6184 584 Left 2 ;Fc = 6.19kHz
LINE Normal 1216 492 1288 420 2
RECTANGLE Normal 1204 376 1328 508 2
RECTANGLE Normal 2084 -72 2232 148 2
RECTANGLE Normal 2092 188 2216 400 2
RECTANGLE Normal 2084 536 2228 732 2
RECTANGLE Normal 2244 416 2384 620 2
RECTANGLE Normal 2396 84 2564 328 2
RECTANGLE Normal 1396 504 1564 572 2
RECTANGLE Normal 260 -300 932 476 2
RECTANGLE Normal 1076 -244 1944 752 2
RECTANGLE Normal 5904 1752 6196 2204 2
RECTANGLE Normal 6220 1740 6364 2220 2
RECTANGLE Normal 5132 1588 5684 2124 2
RECTANGLE Normal 6096 72 6388 524 2
RECTANGLE Normal 6412 60 6556 540 2
RECTANGLE Normal 5324 -92 5876 444 2

The netlist it stands for:
* JC77.asc
R1 N034 N033 33k
C1 N035 N034 82n
D1 N035 15V D
D2 -15V N035 D
R2 N036 N035 1k
C2 N036 0 100p
R3 N003 0 39k
R4 N036 0 1000k
XU1 N036 N003 15V -15V N004 LT1001  ; pins In+ In- V+ V- OUT
C3 N004 N003 47p
R5 N004 N003 100k
C4 N028 N004 82n
R6 N028 0 1000k
XU2 N028 N001 15V -15V N002 LT1001  ; pins In+ In- V+ V- OUT
C5 N002 N001 100p
R7 N002 N001 47k
R8 N001 N051 1k
C6 N051 N055 10µ
D3 0 15V D
D4 -15V 0 D
R9 0 N055 50k
C7 N026 N002 82n
R10 N027 N026 3.9k
R11 N011 N027 3.9k
R12 N026 0 270k
D5 N027 N049 D
D6 N011 N050 D
D7 N049 N027 D
D8 N050 N011 D
C8 N049 0 82n
C9 N050 0 1µ
C10 N011 0 10n
R13 0 0 1500k
R14 N011 N040 100k
C11 N012 N011 150p
R15 N012 N017 150k
R16 N017 N041 100k
C12 N041 N040 82n
C13 N056 N040 47n
R17 N041 N041 150k
R18 N041 N053 200k
R19 N053 N056 1k
R20 N056 N056 5k
R21 N056 0 5k
C14 N018 N017 470p
R22 N017 N054 100k
R23 N054 N037 300k
R24 N037 0 700k
R25 N018 N037 500k
R26 N037 N037 500k
C15 N045 N037 82n
R27 N045 0 1000k
R28 N009 0 22k
XU3 N045 N009 15V -15V N010 LT1001  ; pins In+ In- V+ V- OUT
C16 N010 N009 100p
R29 N010 N009 270k
C17 N042 N010 1µ
R30 N042 0 270k
V1 N033 0 SINE(0 1 1000)
V2 15V 0 15
V3 0 -15V 15
R31 N043 N042 33k
C18 N044 N043 1µ
R32 N044 0 270k
D9 N044 15V D
D10 -15V N044 D
XU4 N044 N007 15V -15V N008 LT1001  ; pins In+ In- V+ V- OUT
C19 N008 N007 47p
R33 N008 N007 22k
R34 N007 0 27k
C20 N038 N008 1µ
R35 N039 N038 47k
R36 N039 N048 100k
XU5 N039 N005 15V -15V N006 LT1001  ; pins In+ In- V+ V- OUT
C21 N006 N005 47p
R37 N006 N005 100k
R38 N005 0 33k
R39 N006 0 100k
R40 N029 0 100k
C22 N029 N006 1µ
R41 N030 N029 5.6k
R42 N084 N083 5.6k
R43 N085 N084 56k
C24 N084 0 2.2n
C25 N085 0 220p
R45 -15V N092 10k
R46 N092 0 7.5k
C26 N092 0 100µ
R47 N083 N092 270k
C27 N083 N008 47n
XU6 N085 N069 0 -15V N070 LT1001  ; pins In+ In- V+ V- OUT
C23 N070 N069 47p
R44 N070 N069 22k
R48 N069 N092 22k
R49 N069 N093 5.6k
C28 N093 N092 10n
R64 N081 N070 1k
R65 15V N075 56k
C40 0 15V 1m
C41 N076 N075 47n
R66 N077 N076 8.2k
R67 N078 N077 8.2k
R68 N079 N078 8.2k
R69 N076 N092 100k
C42 N077 0 2.2n
C43 N078 N082 8.2n
C44 N079 0 470p
Q1 15V N079 N082 0 NPN
R70 N082 0 10k
C45 N087 N082 47n
R72 N086 N087 100k
R71 N086 N092 33k
R73 N071 N092 47k
XU9 N071 N086 15V 0 N072 LT1001  ; pins In+ In- V+ V- OUT
R74 N072 N071 47k
R75 N072 N073 8.2k
C46 N073 N071 4.7n
XU11 N107 N113 15V 0 N117 LT1001  ; pins In+ In- V+ V- OUT
XU12 N119 N107 15V 0 N118 LT1001  ; pins In+ In- V+ V- OUT
R76 N119 N117 68k
C47 N117 N113 27p
R77 N117 N126 51k
R78 N126 N127 50k
R79 N127 0 50k
C48 N126 0 1µ
C49 N127 0 1µ
R80 N128 N127 62k
C50 N119 0 0.22µ
R81 N118 N119 120k
R82 N108 N118 100k
R83 N108 N107 100k
R84 N113 N113 500k
R85 N108 N113 500k
R86 15V N107 12k
R87 N107 0 12k
J2 RC N128 R NJF
R88 RC N128 300k
R89 RC R 22k
C51 C RC 620p
XU13 N103 N091 15V -15V N091 LT1001  ; OP07, pins In+ In- V+ V- OUT
C52 N102 N101 100n
C53 N103 N102 100n
R90 0 N103 47k
R91 N091 N102 10k
R92 N094 N091 5k
C54 N095 N094 2µ
R93 N095 N105 120
C55 N105 0 220n
L6 N105 0 3m
R94 N095 N104 100
C56 N104 N106 80n
L7 N106 0 8m
R95 N096 N095 100
R96 N097 N096 100
C57 N096 0 100n
R97 N100 N099 100
R98 N100 0 10k
C58 N100 0 22n
XU14 N100 N089 15V -15V N090 LT1001  ; OP07, pins In+ In- V+ V- OUT
R99 N090 N089 22k
R100 N089 N088 1k
C59 N088 0 10µ
C60 N110 N114 20n
C61 N114 N120 100n
R101 N114 N123 100
R102 N120 0 200k
XU15 N120 N123 15V -15V N123 LT1001  ; OP07, pins In+ In- V+ V- OUT
C62 N111 N115 20n
C63 N115 N121 100n
R103 N115 N124 100
R104 N121 0 200k
XU16 N121 N124 15V -15V N124 LT1001  ; OP07, pins In+ In- V+ V- OUT
C64 N112 N116 30n
C65 N116 N122 100n
R105 N116 N125 100
R106 N122 0 500k
XU17 N122 N125 15V -15V N125 LT1001  ; OP07, pins In+ In- V+ V- OUT
R107 N099 N098 100
R108 N098 N111 2k
R109 N099 N112 2k
R110 N098 N097 1k
R111 N097 N110 1k
XU7 N032 N016 15V -15V N016 LT1001  ; OP07, pins In+ In- V+ V- OUT
C29 N031 N030 100n
C30 N032 N031 100n
R50 0 N032 47k
R51 N016 N031 10k
R52 N019 N016 5k
C31 N020 N019 2µ
R53 N020 N047 120
C32 N047 0 220n
L1 N047 0 3m
R54 N020 N046 100
C33 N046 N052 80n
L2 N052 0 8m
R55 N021 N020 100
R56 N022 N021 100
C34 N021 0 100n
R57 N025 N024 100
R58 N025 0 10k
C35 N025 0 22n
XU8 N025 N014 15V -15V N015 LT1001  ; OP07, pins In+ In- V+ V- OUT
R59 N015 N014 30k
R60 N014 N013 1k
C36 N013 0 10µ
C37 N057 N060 20n
C38 N060 N063 100n
R61 N060 N066 100
R62 N063 0 200k
XU18 N063 N066 15V -15V N066 LT1001  ; OP07, pins In+ In- V+ V- OUT
C39 N058 N061 20n
C66 N061 N064 100n
R63 N061 N067 100
R112 N064 0 200k
XU19 N064 N067 15V -15V N067 LT1001  ; OP07, pins In+ In- V+ V- OUT
C67 N059 N062 30n
C68 N062 N065 100n
R113 N062 N068 100
R114 N065 0 500k
XU20 N065 N068 15V -15V N068 LT1001  ; OP07, pins In+ In- V+ V- OUT
R115 N024 N023 100
R116 N023 N058 2k
R117 N024 N059 2k
R118 N023 N022 1k
R119 N022 N057 1k
.model D D
.lib standard.dio
.model NPN NPN
.model PNP PNP
.lib standard.bjt
.model NJF NJF
.model PJF PJF
.lib standard.jft
* Distortion Pot
* VOLUME
* HI TREBLE
* TREBLE
* MIDDLE
* BASS
* Switch
.tran 0 15.1 15
* Filters
* Distortion
* Rate
* Depth
* Band Pass Filter
* High Notch Band Stop
* Fc = 6.3kHz
* High Pass Filter
* Fc = 6.19kHz
* Band Pass Filter
* High Notch Band Stop
* Fc = 6.3kHz
* High Pass Filter
* Fc = 6.19kHz
.lib LTC.lib
.backanno
.end